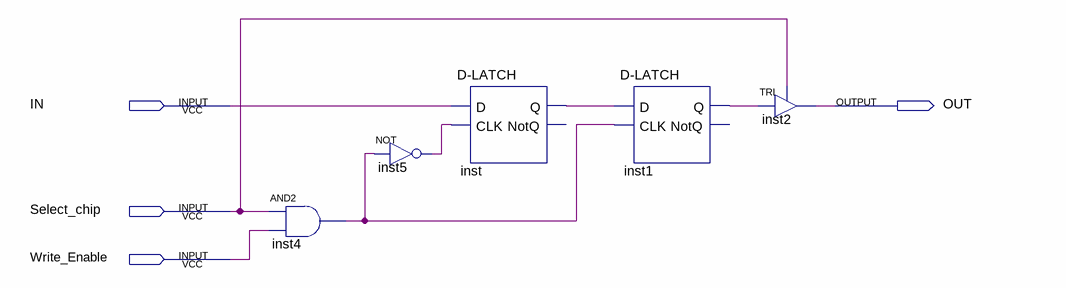
[diagram p0: schematic sheet]
// Quartus schematic SRAM_CELL.bdf as structural Verilog: 5 symbols, 4 pins
module SRAM_CELL (
  input  IN,
  input  Select_chip,
  input  Write_Enable,
  output OUT
);

  wire inst1_q, inst4_out, inst5_out, inst_q;

  and inst4 (inst4_out, Select_chip, Write_Enable);
  not inst5 (inst5_out, inst4_out);
  \D-LATCH  inst (.D(IN), .CLK(inst5_out), .Q(inst_q));  // open: NotQ
  \D-LATCH  inst1 (.D(inst_q), .CLK(inst4_out), .Q(inst1_q));  // open: NotQ
  TRI inst2 (.IN(inst1_q), .OE(Select_chip), .OUT(OUT));
endmodule
